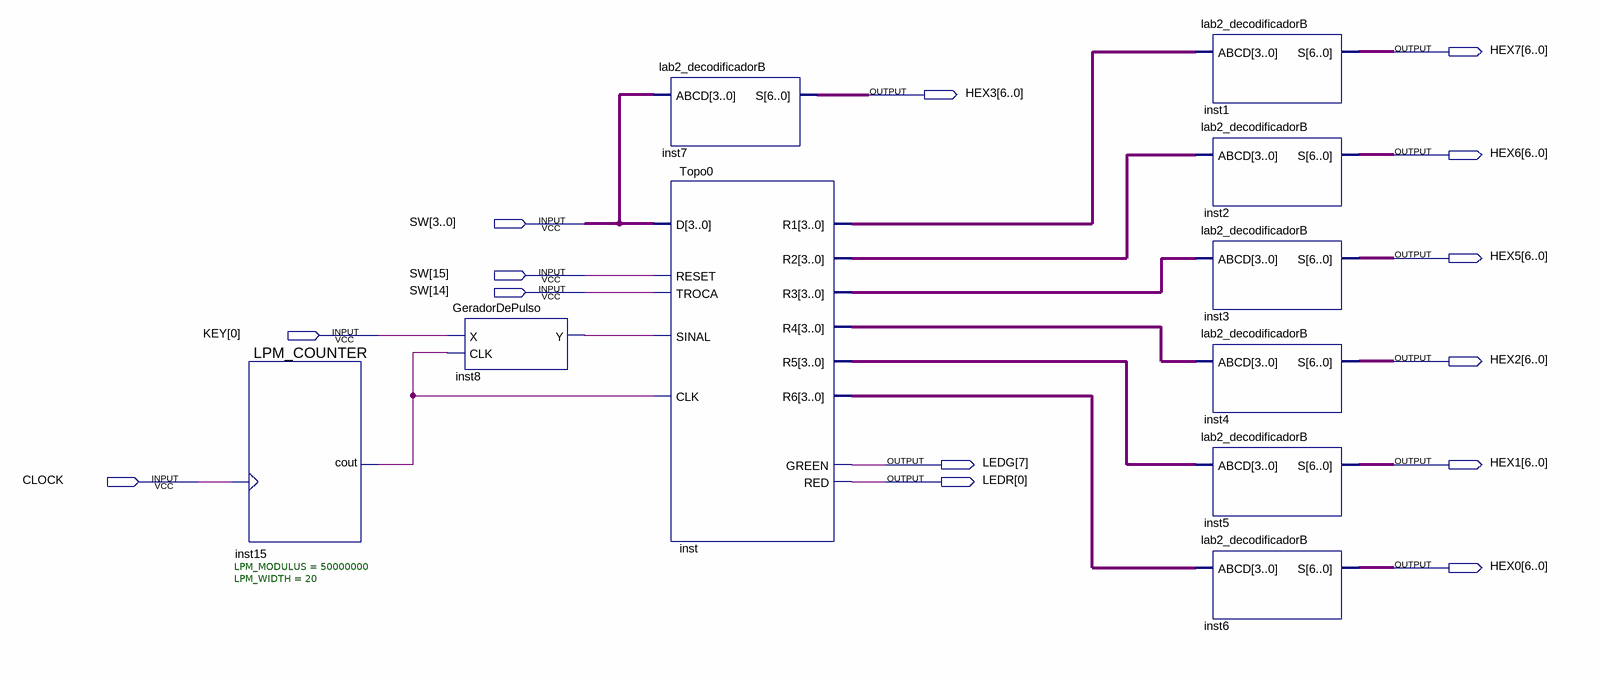
[diagram p0: schematic sheet]
// Quartus schematic Topo.bdf as structural Verilog: 10 symbols, 14 pins
module Topo (
  input  [15:0] SW,
  input  [0:0] KEY,
  input  CLOCK,
  output [6:0] HEX7,
  output [6:0] HEX3,
  output [6:0] HEX6,
  output [6:0] HEX5,
  output [6:0] HEX2,
  output [7:7] LEDG,
  output [6:0] HEX1,
  output [0:0] LEDR,
  output [6:0] HEX0
);

  wire inst8_y, inst15_cout;
  wire [3:0] inst_r1, inst_r2, inst_r3, inst_r4, inst_r5, inst_r6;

  LPM_COUNTER #(.LPM_MODULUS(50000000), .LPM_WIDTH(20)) inst15 (.clock(CLOCK), .cout(inst15_cout));
  GeradorDePulso inst8 (.X(KEY[0]), .CLK(inst15_cout), .Y(inst8_y));
  lab2_decodificadorB inst7 (.ABCD(SW[3:0]), .S(HEX3));
  Topo0 inst (
    .D(SW[3:0]), .CLK(inst15_cout), .SINAL(inst8_y), .RESET(SW[15]), .TROCA(SW[14]), .R1(inst_r1),
    .R4(inst_r4), .R2(inst_r2), .GREEN(LEDG[7]), .R5(inst_r5), .RED(LEDR[0]), .R3(inst_r3), .R6(inst_r6));
  lab2_decodificadorB inst1 (.ABCD(inst_r1), .S(HEX7));
  lab2_decodificadorB inst2 (.ABCD(inst_r2), .S(HEX6));
  lab2_decodificadorB inst3 (.ABCD(inst_r3), .S(HEX5));
  lab2_decodificadorB inst4 (.ABCD(inst_r4), .S(HEX2));
  lab2_decodificadorB inst5 (.ABCD(inst_r5), .S(HEX1));
  lab2_decodificadorB inst6 (.ABCD(inst_r6), .S(HEX0));
endmodule
